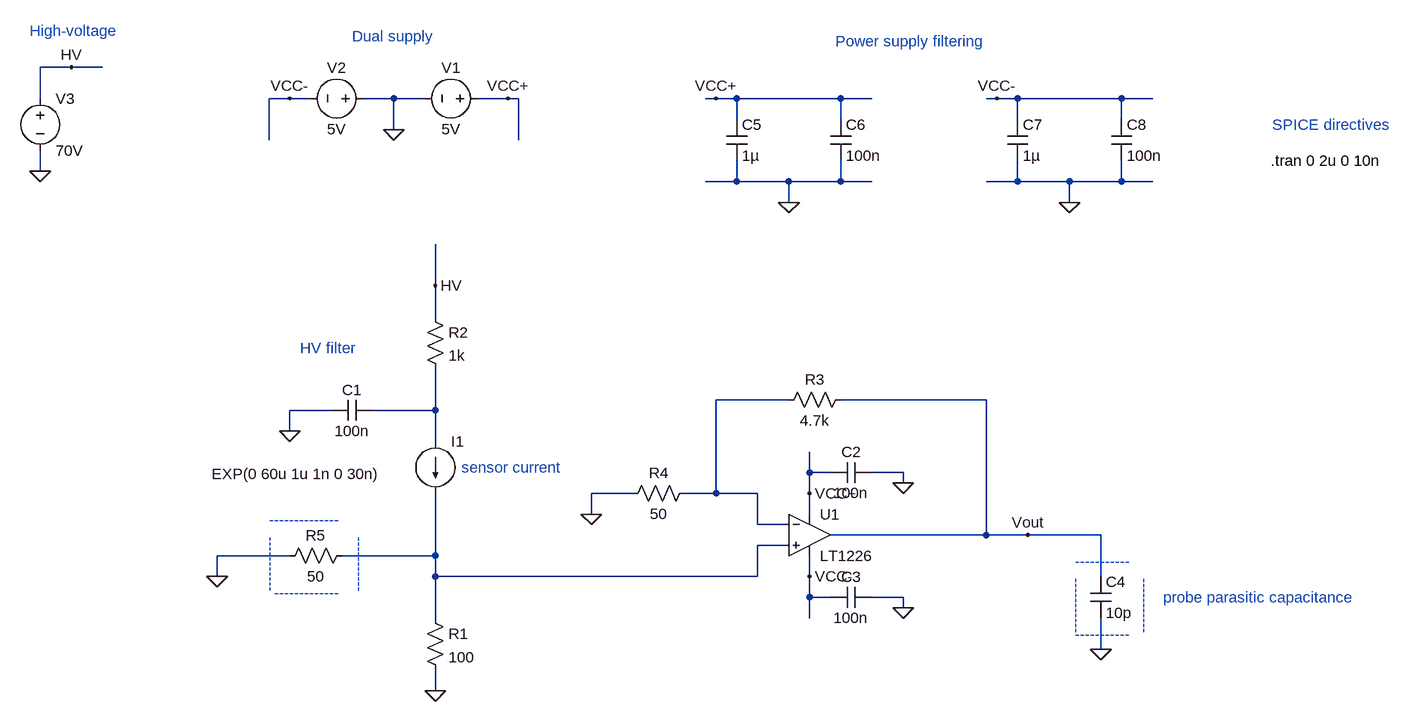
[diagram p0: schematic MPPC_preamp.asc]
MPPC_preamp.asc, the LTspice schematic file:
Version 4
SHEET 1 1912 856
WIRE -848 -176 -896 -176
WIRE -800 -176 -848 -176
WIRE -896 -128 -896 -176
WIRE -512 -128 -544 -128
WIRE -480 -128 -512 -128
WIRE -352 -128 -400 -128
WIRE -304 -128 -352 -128
WIRE -176 -128 -224 -128
WIRE -160 -128 -176 -128
WIRE 144 -128 128 -128
WIRE 176 -128 144 -128
WIRE 336 -128 176 -128
WIRE 384 -128 336 -128
WIRE 576 -128 560 -128
WIRE 608 -128 576 -128
WIRE 768 -128 608 -128
WIRE 816 -128 768 -128
WIRE 176 -96 176 -128
WIRE 336 -96 336 -128
WIRE 608 -96 608 -128
WIRE 768 -96 768 -128
WIRE -352 -80 -352 -128
WIRE -544 -64 -544 -128
WIRE -160 -64 -160 -128
WIRE -896 -16 -896 -48
WIRE 176 0 176 -32
WIRE 176 0 128 0
WIRE 256 0 176 0
WIRE 336 0 336 -32
WIRE 336 0 256 0
WIRE 384 0 336 0
WIRE 608 0 608 -32
WIRE 608 0 560 0
WIRE 688 0 608 0
WIRE 768 0 768 -32
WIRE 768 0 688 0
WIRE 816 0 768 0
WIRE 256 32 256 0
WIRE 688 32 688 0
WIRE -288 160 -288 96
WIRE -288 208 -288 160
WIRE 256 336 144 336
WIRE 560 336 336 336
WIRE -448 352 -512 352
WIRE -288 352 -288 288
WIRE -288 352 -384 352
WIRE -512 384 -512 352
WIRE -288 400 -288 352
WIRE 288 448 288 416
WIRE 320 448 288 448
WIRE 432 448 384 448
WIRE 432 464 432 448
WIRE 16 480 -48 480
WIRE 144 480 144 336
WIRE 144 480 96 480
WIRE 208 480 144 480
WIRE 288 480 288 448
WIRE -48 512 -48 480
WIRE 288 512 288 480
WIRE 208 528 208 480
WIRE 256 528 208 528
WIRE 560 544 560 336
WIRE 560 544 320 544
WIRE 624 544 560 544
WIRE 736 544 624 544
WIRE 256 560 208 560
WIRE -512 576 -624 576
WIRE -288 576 -288 480
WIRE -288 576 -432 576
WIRE -624 608 -624 576
WIRE -288 608 -288 576
WIRE 208 608 208 560
WIRE 208 608 -288 608
WIRE 288 608 288 576
WIRE 736 608 736 544
WIRE 288 640 288 608
WIRE 320 640 288 640
WIRE 432 640 384 640
WIRE 432 656 432 640
WIRE -288 672 -288 608
WIRE 288 672 288 640
WIRE 736 720 736 672
WIRE -288 784 -288 752
FLAG -352 -80 0
FLAG 288 480 VCC+
FLAG 288 608 VCC-
FLAG -176 -128 VCC+
FLAG -512 -128 VCC-
FLAG -288 784 0
FLAG -288 160 HV
FLAG -512 384 0
FLAG -48 512 0
FLAG 432 464 0
FLAG 432 656 0
FLAG -896 -16 0
FLAG -848 -176 HV
FLAG 624 544 Vout
FLAG 736 720 0
FLAG -624 608 0
FLAG 256 32 0
FLAG 688 32 0
FLAG 144 -128 VCC+
FLAG 576 -128 VCC-
SYMBOL Opamps\\LT1226 288 480 R0
SYMATTR InstName U1
SYMBOL voltage -208 -128 R90
WINDOW 0 -32 56 VBottom 2
WINDOW 3 32 56 VTop 2
WINDOW 123 0 0 Left 2
WINDOW 39 0 0 Left 2
SYMATTR InstName V1
SYMATTR Value 5V
SYMBOL voltage -384 -128 R90
WINDOW 0 -32 56 VBottom 2
WINDOW 3 32 56 VTop 2
WINDOW 123 0 0 Left 2
WINDOW 39 0 0 Left 2
SYMATTR InstName V2
SYMATTR Value 5V
SYMBOL res -304 656 R0
SYMATTR InstName R1
SYMATTR Value 100
SYMBOL current -288 400 R0
WINDOW 3 -344 50 Left 2
WINDOW 123 0 0 Left 2
WINDOW 39 0 0 Left 2
SYMATTR InstName I1
SYMATTR Value EXP(0 60u 1u 1n 0 30n)
SYMBOL res -304 192 R0
SYMATTR InstName R2
SYMATTR Value 1k
SYMBOL cap -384 336 R90
WINDOW 0 0 32 VBottom 2
WINDOW 3 32 32 VTop 2
SYMATTR InstName C1
SYMATTR Value 100n
SYMBOL res 352 320 R90
WINDOW 0 0 56 VBottom 2
WINDOW 3 32 56 VTop 2
SYMATTR InstName R3
SYMATTR Value 4.7k
SYMBOL res 112 464 R90
WINDOW 0 0 56 VBottom 2
WINDOW 3 32 56 VTop 2
SYMATTR InstName R4
SYMATTR Value 50
SYMBOL cap 384 432 R90
WINDOW 0 0 32 VBottom 2
WINDOW 3 32 32 VTop 2
SYMATTR InstName C2
SYMATTR Value 100n
SYMBOL cap 384 624 R90
WINDOW 0 0 32 VBottom 2
WINDOW 3 32 32 VTop 2
SYMATTR InstName C3
SYMATTR Value 100n
SYMBOL voltage -896 -144 R0
WINDOW 123 0 0 Left 2
WINDOW 39 0 0 Left 2
SYMATTR InstName V3
SYMATTR Value 70V
SYMBOL cap 720 608 R0
SYMATTR InstName C4
SYMATTR Value 10p
SYMBOL res -416 560 R90
WINDOW 0 0 56 VBottom 2
WINDOW 3 32 56 VTop 2
SYMATTR InstName R5
SYMATTR Value 50
SYMBOL cap 160 -96 R0
SYMATTR InstName C5
SYMATTR Value 1µ
SYMBOL cap 320 -96 R0
SYMATTR InstName C6
SYMATTR Value 100n
SYMBOL cap 592 -96 R0
SYMATTR InstName C7
SYMATTR Value 1µ
SYMBOL cap 752 -96 R0
SYMATTR InstName C8
SYMATTR Value 100n
TEXT 998 -32 Left 2 !.tran 0 2u 0 10n
TEXT 696 584 Left 2 ;-----------
TEXT 696 696 VLeft 2 ;-----------
TEXT 800 696 VLeft 2 ;-----------
TEXT 696 696 Left 2 ;-----------
TEXT -544 632 VLeft 2 ;-----------
TEXT -544 520 Left 2 ;--------------
TEXT -536 632 Left 2 ;-------------
TEXT -408 632 VLeft 2 ;-----------
TEXT -416 -224 Left 2 ;Dual supply
TEXT 1000 -88 Left 2 ;SPICE directives
TEXT 832 640 Left 2 ;probe parasitic capacitance
TEXT -912 -232 Left 2 ;High-voltage
TEXT -248 440 Left 2 ;sensor current
TEXT 328 -216 Left 2 ;Power supply filtering
TEXT -496 256 Left 2 ;HV filter

The netlist it stands for:
* MPPC_preamp.asc
XU1 N003 N001 VCC+ VCC- Vout LT1226  ; pins In+ In- V+ V- OUT
V1 VCC+ 0 5V
V2 0 VCC- 5V
R1 N003 0 100
I1 N002 N003 EXP(0 60u 1u 1n 0 30n)
R2 HV N002 1k
C1 N002 0 100n
R3 Vout N001 4.7k
R4 N001 0 50
C2 0 VCC+ 100n
C3 0 VCC- 100n
V3 HV 0 70V
C4 Vout 0 10p
R5 N003 0 50
C5 VCC+ 0 1µ
C6 VCC+ 0 100n
C7 VCC- 0 1µ
C8 VCC- 0 100n
.tran 0 2u 0 10n
* -----------
* -----------
* -----------
* -----------
* -----------
* --------------
* -------------
* -----------
* Dual supply
* SPICE directives
* probe parasitic capacitance
* High-voltage
* sensor current
* Power supply filtering
* HV filter
.backanno
.end